# Altium schematic sheet Levels.SchDoc
size Tabloid
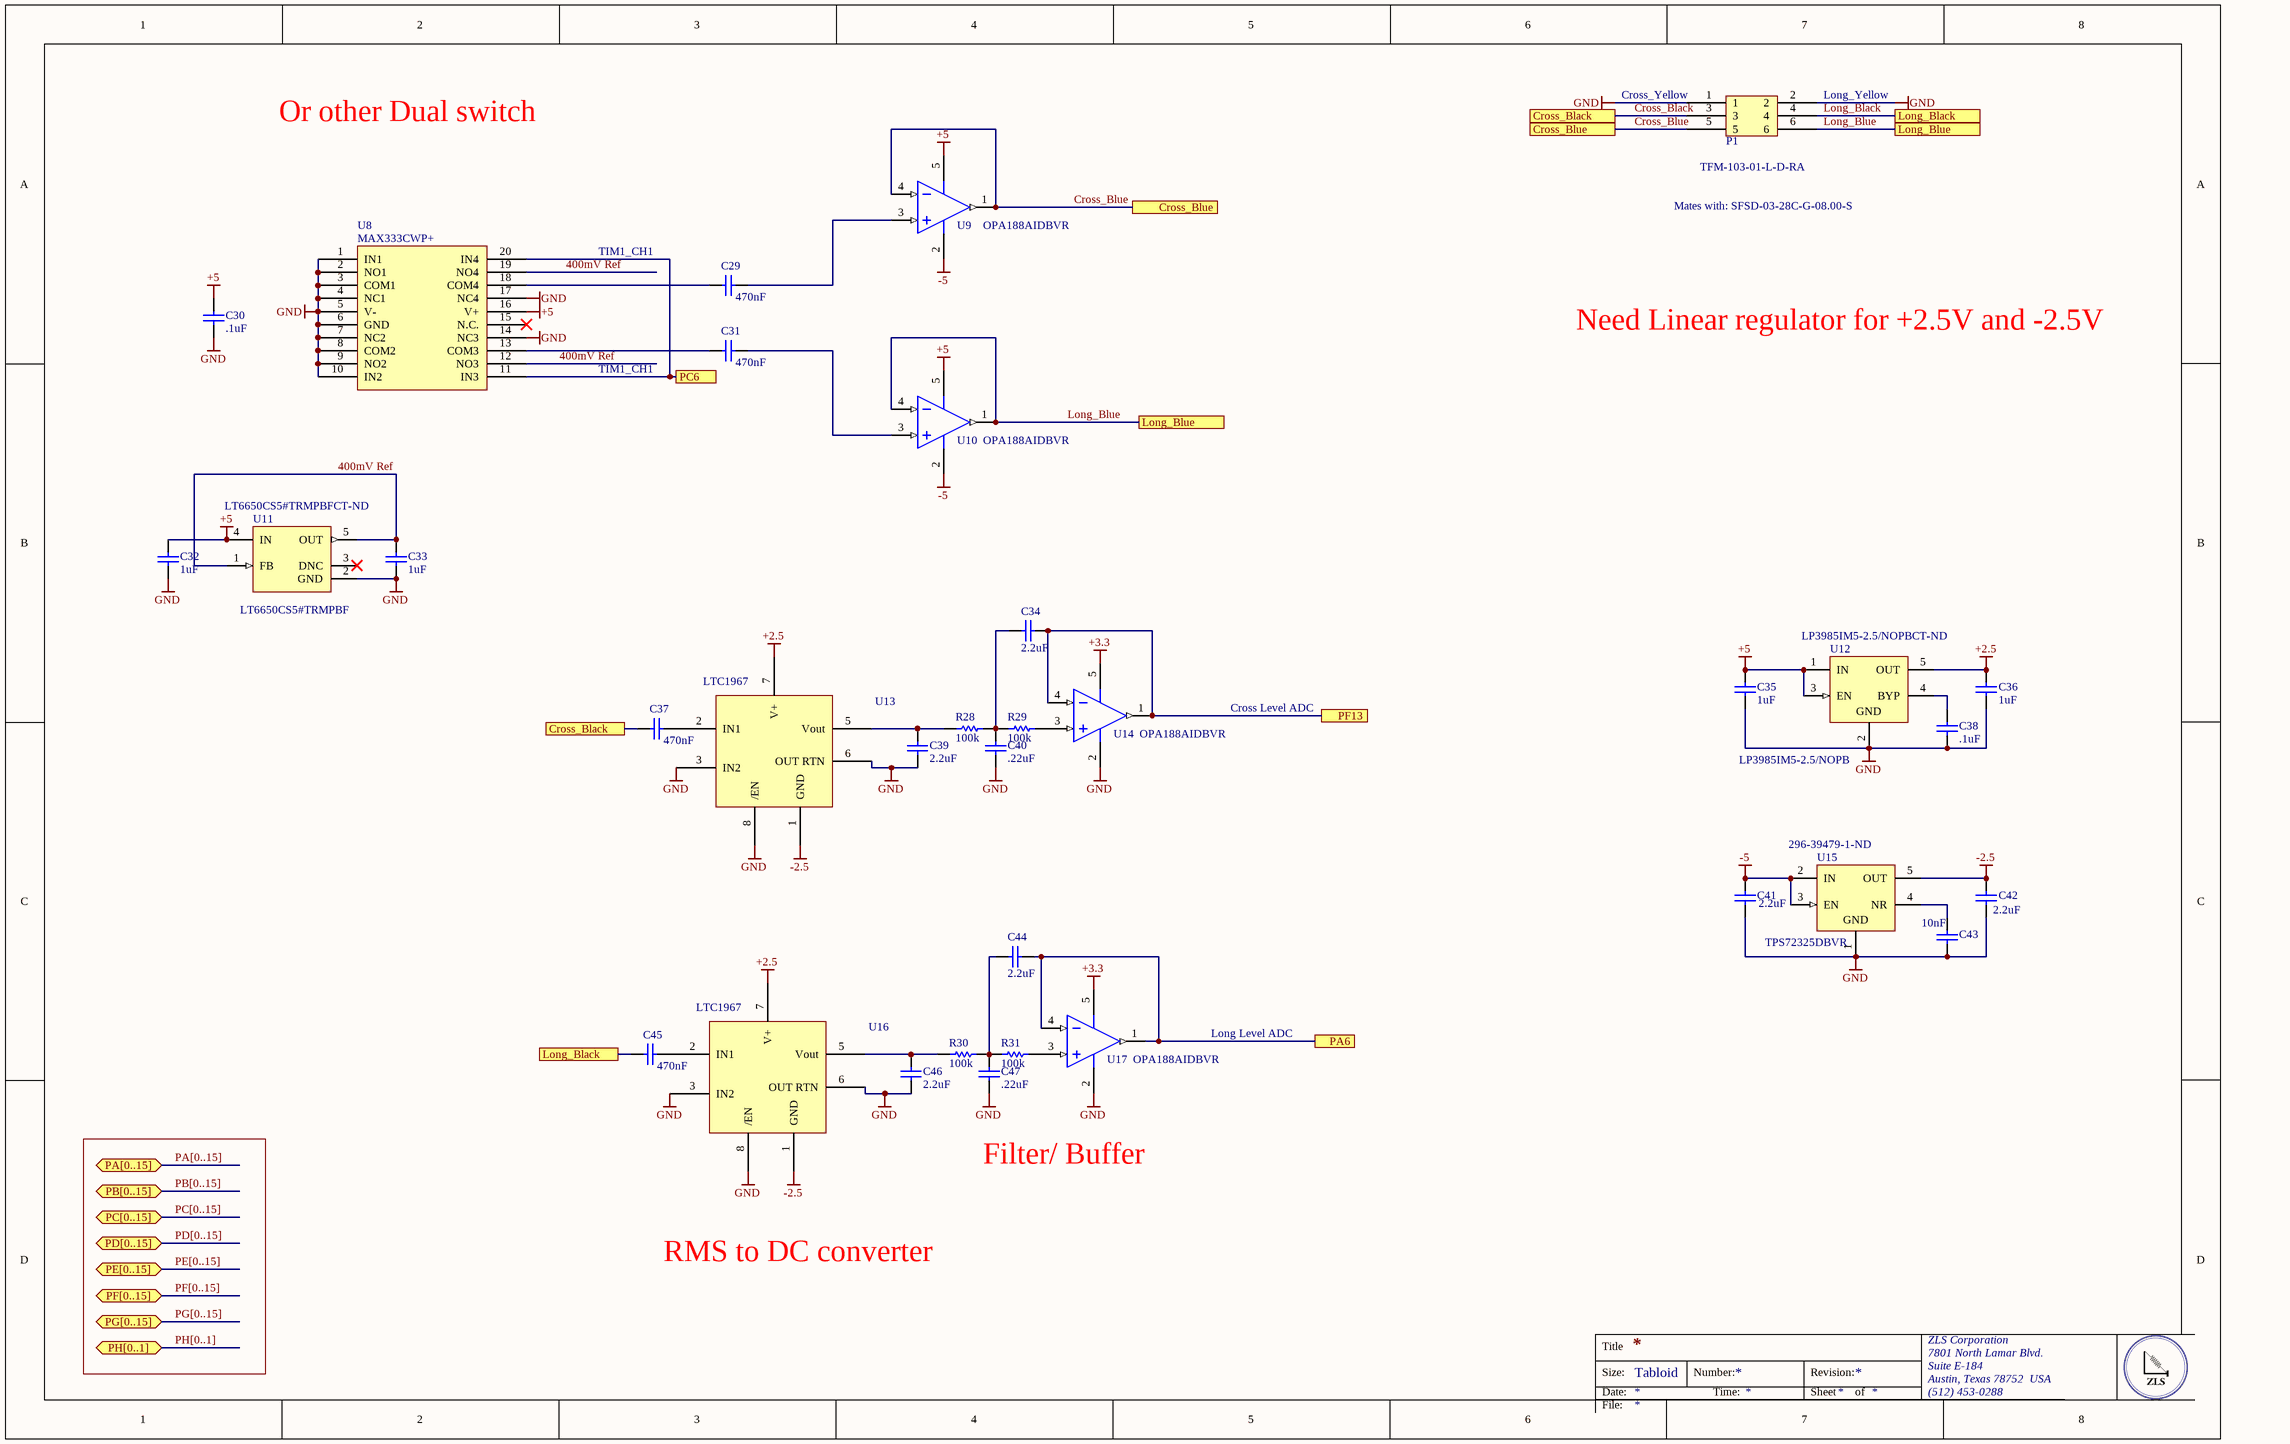
[diagram p0: Levels.SchDoc]

## Parts
C29  470nF  [CAPC0805(2012)75_L]
C30  .1uF  [CAPC0805(2012)75_L]
C31  470nF  [CAPC0805(2012)75_L]
C32  Capacitance: 1uF  [CAPC0805(2012)145_N]  (hidden comment: 08053C105JAT2A)
C33  Capacitance: 1uF  [CAPC0805(2012)145_N]  (hidden comment: 08053C105JAT2A)
C34  2.2uF  [CAPC0805(2012)75_L]
C35  Capacitance: 1uF  [CAPC0805(2012)145_N]  (hidden comment: 08053C105JAT2A)
C36  Capacitance: 1uF  [CAPC0805(2012)145_N]  (hidden comment: 08053C105JAT2A)
C37  470nF  [CAPC0805(2012)75_L]
C38  .1uF  [CAPC0805(2012)75_L]
C39  2.2uF  [CAPC0805(2012)75_L]
C40  .22uF  [CAPC0805(2012)75_L]
C41  Capacitance: 2.2uF  [CAPC2013X135X50ML10T20]  (hidden comment: GRM21BR71A225KA01L)
C42  Capacitance: 2.2uF  [CAPC2013X135X50ML10T20]  (hidden comment: GRM21BR71A225KA01L)
C43  Capacitance: 10nF  [CAPC2013X140X50NL20T25]  (hidden comment: 0805ZC103KAT2A)
C44  2.2uF  [CAPC0805(2012)75_L]
C45  470nF  [CAPC0805(2012)75_L]
C46  2.2uF  [CAPC0805(2012)75_L]
C47  .22uF  [CAPC0805(2012)75_L]
P1  TFM-103-01-L-D-RA  [TFM-103-01-L-D-RA]
R28  100k  [RESC0805(2012)_L]
R29  100k  [RESC0805(2012)_L]
R30  100k  [RESC0805(2012)_L]
R31  100k  [RESC0805(2012)_L]
U8  MAX333CWP+  [TSOP65P640X90-20N]
U9  OPA188AIDBVR  [DBV0005A_M]
U10  OPA188AIDBVR  [DBV0005A_M]
U11  LT6650CS5#TRMPBF  Supplier Part Number 1: LT6650CS5#TRMPBFCT-ND  [LT-S5-5-TSOT-23_N]
U12  LP3985IM5-2.5/NOPB  Supplier Part Number 1: LP3985IM5-2.5/NOPBCT-ND  [DBV0005A_M]
U13  LTC1967  [LTC1967]
U14  OPA188AIDBVR  [DBV0005A_M]
U15  TPS72325DBVR  Supplier Part Number 1: 296-39479-1-ND  [DBV0005A_N]
U16  LTC1967  [LTC1967]
U17  OPA188AIDBVR  [DBV0005A_M]

## Ports
Cross_Black, Cross_Blue, Long_Black, Long_Blue, PA6, PA[0..15] (bidir), PB[0..15] (bidir), PC6, PC[0..15] (bidir), PD[0..15] (bidir), PE[0..15] (bidir), PF13, PF[0..15] (bidir), PG[0..15] (bidir), PH[0..1] (bidir)

## Nets
+2.5: C36.2 U12.5(OUT) U13.7(V+) U16.7(V+)
+3.3: U14.5(V+) U17.5(V+)
+5: C30.2 C32.2 C35.2 U8.16(V+) U9.5(V+) U10.5(V+) U11.4(IN) U12.1(IN) U12.3(EN)
-2.5: C42.2 U13.1(GND) U15.5(OUT) U16.1(GND)
-5: C41.2 U9.2(V-) U10.2(V-) U15.2(IN) U15.3(EN)
GND: C30.1 C32.1 C33.1 C35.1 C36.1 C38.1 C39.1 C40.1 C41.1 C42.1 C43.1 C46.1 C47.1 P1.1 P1.2 U8.1(IN1) U8.2(NO1) U8.3(COM1) U8.4(NC1) U8.5(V-) U8.6(GND) U8.7(NC2) U8.8(COM2) U8.9(NO2) U8.10(IN2) U8.14(NC3) U8.17(NC4) U11.2(GND) U12.2(GND) U13.3(IN2) U13.6(OUT_RTN) U13.8(/EN) U14.2(V-) U15.1(GND) U16.3(IN2) U16.6(OUT_RTN) U16.8(/EN) U17.2(V-)
400mV Ref: C33.2 U8.12(NO3) U8.19(NO4) U11.1(FB) U11.5(OUT)
Cross_Black: C37.1 P1.3 ; port Cross_Black
Cross_Blue: P1.5 U9.1(OUT) U9.4(IN-) ; port Cross_Blue
Long_Black: C45.1 P1.4 ; port Long_Black
Long_Blue: P1.6 U10.1(OUT) U10.4(IN-) ; port Long_Blue
PA6: C44.1 U17.1(OUT) U17.4(IN-) ; port PA6
PC6: U8.11(IN3) U8.20(IN4) ; port PC6
PF13: C34.1 U14.1(OUT) U14.4(IN-) ; port PF13
NetC29_1: C29.1 U8.18(COM4)
NetC29_2: C29.2 U9.3(IN+)
NetC31_1: C31.1 U8.13(COM3)
NetC31_2: C31.2 U10.3(IN+)
NetC34_2: C34.2 C40.2 R28.1 R29.2
NetC37_2: C37.2 U13.2(IN1)
NetC38_2: C38.2 U12.4(BYP)
NetC39_2: C39.2 R28.2 U13.5(Vout)
NetC43_2: C43.2 U15.4(NR)
NetC44_2: C44.2 C47.2 R30.1 R31.2
NetC45_2: C45.2 U16.2(IN1)
NetC46_2: C46.2 R30.2 U16.5(Vout)
NetR29_1: R29.1 U14.3(IN+)
NetR31_1: R31.1 U17.3(IN+)

Not connected (* = marked no-connect by the designer): U8 15(N.C.)*; U11 3(DNC)*; U13 4(NC); U16 4(NC)

## Buses and harness runs
bus PA[0..15] = port PA[0..15]
bus PB[0..15] = port PB[0..15]
bus PC[0..15] = port PC[0..15]
bus PD[0..15] = port PD[0..15]
bus PE[0..15] = port PE[0..15]
bus PF[0..15] = port PF[0..15]
bus PG[0..15] = port PG[0..15]
bus PH[0..1] = port PH[0..1]

## Notes on the sheet
- Or other Dual switch
- (near P1) Cross_Yellow
- (near P1) Long_Yellow
- Mates with: SFSD-03-28C-G-08.00-S
- TIM1_CH1
- Need Linear regulator for +2.5V and -2.5V
- Cross Level ADC
- Long Level ADC
- Filter/ Buffer
- RMS to DC converter
- Title
- Size:
- Date:
- Tabloid
- Number:
- Time:
- Revision:
- Sheet
- of
- ZLS Corporation
- 7801 North Lamar Blvd.
- Suite E-184
- Austin, Texas 78752  USA
- (512) 453-0288
- File:

## Library data of the parts
C29 C31 C37 C45 = CMP-1036-02117-1: CAP 150pF 16V ±10% 0805 (2012 Metric) Thickness 0.75mm SMD; Case-EIA: 0805; Tolerance: Â±10%; Value: .47uF; Case-Metric: 2012; Technology: SMT; Max Thickness: 0.75 mm; Rated Voltage: 16 V
C30 = CMP-1036-02117-1: CAP 150pF 16V ±10% 0805 (2012 Metric) Thickness 0.75mm SMD; Case-EIA: 0805; Tolerance: Â±10%; Case-Metric: 2012; Technology: SMT; Max Thickness: 0.75 mm; Rated Voltage: 16 V; Value: .1uF
C32 C33 C35 C36 = CMP-1036-04752-1: 1µF ±5% 25V Ceramic Capacitor X7R 0805 (2012 Metric); Manufacturer: Kyocera AVX; Tolerance: Â±5%; Case-Metric: 2012; Case-EIA: 0805; Value: 1uF; Technology: SMT; Rated Voltage: 25 V; Max Thickness: 1.45 mm; Supplier 1: Digi-Key; Supplier Part Number 1: 478-10487-1-ND; Manufacturer Part Number: 08053C105JAT2A; Stock 1: 13701; Pricing 1: 1=0.44000, 10=0.30400, 100=0.18220, 500=0.13662, 1000=0.11537 (USD); RoHS: Yes; Mount: Surface Mount; Case/Package: 0805; Number of Pins: 2; Case Code (Metric): 2012; Case Code (Imperial): 0805; Contact Plating: Tin; Min Operating Temperature: -55°C; Max Operating Temperature: 125°C; Packaging: Tape and Reel; Voltage Rating: 25V; Package Quantity: 2000; Dielectric: X7R; Voltage Rating (DC): 25V; Termination: SMD/SMT; Length: 2.01mm; Height: 1.4mm; Width: 0.049inch; Thickness: 0.037inch; Depth: 1.25mm; Radiation Hardening: No; Lead Free: Lead Free; REACH SVHC: Unknown; ComponentLink1URL: https://datasheet.ciiva.com/221/cx7r-221690.pdf?src-supplier=Digi-Key; ComponentLink1Description: https://datasheet.ciiva.com/221/cx7r-221690.pdf?src-supplier=Digi-Key; ComponentLink2URL: https://datasheet.ciiva.com/5419/cx7r-218113-5419770.pdf?src-supplier=Mouser; ComponentLink2Description: https://datasheet.ciiva.com/5419/cx7r-218113-5419770.pdf?src-supplier=Mouser; ComponentLink3URL: https://datasheet.ciiva.com/28586/1679506-28586091.pdf?src-supplier=Element14; ComponentLink3Description: https://datasheet.ciiva.com/28586/1679506-28586091.pdf?src-supplier=Element14; ComponentLink4URL: https://datasheet.ciiva.com/11499/cx7r-11499836.pdf?src-supplier=Avnet; ComponentLink4Description: https://datasheet.ciiva.com/11499/cx7r-11499836.pdf?src-supplier=Avnet
C34 C39 C40 C44 C46 C47 = CMP-1036-02117-1: CAP 150pF 16V ±10% 0805 (2012 Metric) Thickness 0.75mm SMD; Case-EIA: 0805; Tolerance: Â±10%; Value: 1uF; Case-Metric: 2012; Technology: SMT; Max Thickness: 0.75 mm; Rated Voltage: 16 V
C38 = CMP-1036-02117-1: 0.1µF ±10% 25V Ceramic Capacitor X7R 0805 (2012 Metric); Manufacturer: Vishay; Manufacturer Part Number: VJ0805Y104KXXCW1BC; Dielectric Material: Tantalum; Capacitance: 100nF; Supplier 1: Digi-Key; Supplier Part Number 1: 720-1537-1-ND; Stock 1: 72674; Pricing 1: 1=0.26000, 10=0.17900, 100=0.10120, 500=0.07142, 1000=0.06250 (USD); RoHS: Yes; Mount: Surface Mount; Case/Package: 0805; Number of Pins: 2; Weight: 0.000194oz; Case Code (Imperial): 0805; Case Code (Metric): 2012; Min Operating Temperature: -55°C; Max Operating Temperature: 125°C; Tolerance: 10%; Packaging: Tape and Reel; Package Quantity: 4000; Voltage Rating: 25V; Dielectric: X7R; Voltage Rating (DC): 25V; Termination: SMD/SMT; Length: 2mm; Height: 1.45mm; Width: 1.25mm; Thickness: 0.037inch; Depth: 1.25mm; Lead Free: Lead Free; ComponentLink1URL: https://datasheet.ciiva.com/11491/vjw1bcbascomseries-11491758.pdf?src-supplier=Avnet; ComponentLink1Description: https://datasheet.ciiva.com/11491/vjw1bcbascomseries-11491758.pdf?src-supplier=Avnet; ComponentLink2URL: https://datasheet.ciiva.com/176/vjw1bcbascomseries-176875.pdf?src-supplier=Digi-Key; ComponentLink2Description: https://datasheet.ciiva.com/176/vjw1bcbascomseries-176875.pdf?src-supplier=Digi-Key
C41 C42 = CMP-2007-03454-1: 2.2µF ±10% 10V Ceramic Capacitor X7R 0805 (2012 Metric); Manufacturer: Murata; Dissipation Factor: 0.035%; Part Number: GRM21BR71A225KA01L; Supplier 1: Digi-Key; Supplier Part Number 1: 490-1696-1-ND; Manufacturer Part Number: GRM21BR71A225KA01L; Stock 1: 271684; Pricing 1: 1=0.27000, 10=0.18600, 100=0.09440, 500=0.06458, 1000=0.05713 (USD); RoHS: Yes; Mount: Surface Mount; Case/Package: 0805; Number of Pins: 2; Case Code (Imperial): 0805; Case Code (Metric): 2012; Min Operating Temperature: -55°C; Max Operating Temperature: 125°C; Tolerance: 10%; Packaging: Tape and Reel; Package Quantity: 1; Voltage Rating: 10V; Dielectric: X7R; Voltage Rating (DC): 10V; Termination: SMD/SMT; Voltage: 10V; Length: 2mm; Height: 1.25mm; Width: 1.25mm; Thickness: 0.053inch; Depth: 1.25mm; Radiation Hardening: No; REACH SVHC: No SVHC; Lead Free: Lead Free; ComponentLink1URL: https://datasheet.ciiva.com/2989/product-2989712.pdf?src-supplier=Avnet; ComponentLink1Description: https://datasheet.ciiva.com/2989/product-2989712.pdf?src-supplier=Avnet; ComponentLink2URL: https://datasheet.ciiva.com/3778/grm21br71a225ka0123-3778504.pdf?src-supplier=Arrow; ComponentLink2Description: https://datasheet.ciiva.com/3778/grm21br71a225ka0123-3778504.pdf?src-supplier=Arrow; ComponentLink3URL: https://datasheet.ciiva.com/11786/0900766b80936815-11786251.pdf?src-supplier=RSComponents; ComponentLink3Description: https://datasheet.ciiva.com/11786/0900766b80936815-11786251.pdf?src-supplier=RSComponents; ComponentLink4URL: https://datasheet.ciiva.com/16203/product-16203815.pdf?src-supplier=Future+Electronics; ComponentLink4Description: https://datasheet.ciiva.com/16203/product-16203815.pdf?src-supplier=Future+Electronics; ComponentLink5URL: https://datasheet.ciiva.com/135/partnumbering-e-01-135064.pdf?src-supplier=Digi-Key; ComponentLink5Description: https://datasheet.ciiva.com/135/partnumbering-e-01-135064.pdf?src-supplier=Digi-Key; ComponentLink6URL: https://datasheet.ciiva.com/135/partnumbering-e-01-135065.pdf?src-supplier=Digi-Key; ComponentLink6Description: https://datasheet.ciiva.com/135/partnumbering-e-01-135065.pdf?src-supplier=Digi-Key; ComponentLink7URL: https://datasheet.ciiva.com/135/partnumbering-e-01-135066.pdf?src-supplier=Digi-Key; ComponentLink7Description: https://datasheet.ciiva.com/135/partnumbering-e-01-135066.pdf?src-supplier=Digi-Key; ComponentLink8URL: https://datasheet.ciiva.com/22703/608985-22703358.pdf?src-supplier=Element14; ComponentLink8Description: https://datasheet.ciiva.com/22703/608985-22703358.pdf?src-supplier=Element14; ComponentLink9URL: https://datasheet.ciiva.com/2989/product-2989711.pdf?src-supplier=Avnet; ComponentLink9Description: https://datasheet.ciiva.com/2989/product-2989711.pdf?src-supplier=Avnet
C43 = CMP-2007-04770-1: 10000pF ±10% 10V Ceramic Capacitor X7R 0805 (2012 Metric); Manufacturer: AVX Interconnect / Elco; Part Number: 0805ZC103KAT2A; Supplier 1: Digi-Key; Supplier Part Number 1: 478-11396-1-ND; Manufacturer Part Number: 0805ZC103KAT2A; Stock 1: 11980; Pricing 1: 1=0.32000, 10=0.21700, 100=0.11010, 500=0.07534, 1000=0.06665 (USD); RoHS: Yes; Mount: Surface Mount; Case/Package: 0805; Number of Pins: 2; Case Code (Metric): 2012; Case Code (Imperial): 0805; Min Operating Temperature: -55°C; Max Operating Temperature: 125°C; Tolerance: 10%; Packaging: Tape and Reel; Termination: SMD/SMT; Package Quantity: 4000; Dielectric: X7R; Voltage Rating (DC): 10V; Voltage Rating: 10V; Length: 2.01mm; Width: 0.049inch; Depth: 1.25mm; Thickness: 0.037inch; Radiation Hardening: No; REACH SVHC: Unknown; ComponentLink1URL: https://datasheet.ciiva.com/205/cx7r-205251.pdf?src-supplier=Digi-Key; ComponentLink1Description: https://datasheet.ciiva.com/205/cx7r-205251.pdf?src-supplier=Digi-Key; ComponentLink2URL: https://datasheet.ciiva.com/11508/cx7r-11508056.pdf?src-supplier=Avnet; ComponentLink2Description: https://datasheet.ciiva.com/11508/cx7r-11508056.pdf?src-supplier=Avnet; ComponentLink3URL: https://datasheet.ciiva.com/17489/cx7r-17489036.pdf?src-supplier=Avnet+Europe; ComponentLink3Description: https://datasheet.ciiva.com/17489/cx7r-17489036.pdf?src-supplier=Avnet+Europe; ComponentLink4URL: https://datasheet.ciiva.com/5420/cx7r-5420079.pdf?src-supplier=Mouser; ComponentLink4Description: https://datasheet.ciiva.com/5420/cx7r-5420079.pdf?src-supplier=Mouser
P1 = TFM-103-01-L-D-RA: Manufacturer: Samtec; System: Connector; Supplier 1: Mouser; Supplier Part Number 1: 200-TFM10301LDRA; Manufacturer Part Number: TFM-103-01-L-D-RA; Stock 1: 202; Pricing 1: 1=2.15000, 10=1.78000, 50=1.78000, 100=1.33000, 1000=0.98500, 10000=0.92500 (USD); RoHS: No
R28-R31 = CMP-1013-00215-1: 2R55 0.125W 1% 0805 (2012 Metric)  SMD; Case-Metric: 2012; Case-EIA: 0805; Value: 100k; Tolerance: 1 %; Technology: SMT; Power: 0.125 W
U8 = MAX333CWP+: IC SWITCH QUAD SPDT 20TSSOP; Manufacturer: Maxim; Manufacturer Part Number: MAX333AEUP+; Max Supply Voltage: 30V; Min Supply Voltage: 10V; Min Dual Supply Voltage: 4.5V; Max Dual Supply Voltage: 20V; On-State Resistance: 35R; Operating Supply Current: 1uA; Supply Type: Single,Dual; Max Power Dissipation: 559mW; Turn-On Delay Time: 175ns; Turn-Off Delay Time: 145ns; Max Supply Current: 250uA; Number of Bits: 4; Dual Supply Voltage: 15V; Supplier 1: Mouser; Supplier Part Number 1: 700-MAX333AEUP; Stock 1: 664; Pricing 1: 1=6.77, 10=6.43, 50=5.8, 100=5.8, 1000=5.62, 10000=5.62 (USD); Case/Package: TSSOP; Number of Pins: 20; Weight: 0.006737oz; Min Operating Temperature: -40°C; Max Operating Temperature: 85°C; Packaging: Rail/Tube; Package Quantity: 74; Throw Configuration: SPDT; Number of Channels: 4; Length: 6.6mm; Height: 0.95mm; Width: 4.5mm; Radiation Hardening: No; Lead Free: Lead Free; REACH SVHC: Unknown; ComponentLink1URL: https://datasheet.ciiva.com/2978/max333a-2978850.pdf; ComponentLink1Description: https://datasheet.ciiva.com/2978/max333a-2978850.pdf; ComponentLink2URL: https://datasheet.ciiva.com/30478/0900766b81253c85-30478260.pdf; ComponentLink2Description: https://datasheet.ciiva.com/30478/0900766b81253c85-30478260.pdf; ComponentLink3URL: https://datasheet.ciiva.com/1674/max333a-1674617.pdf; ComponentLink3Description: https://datasheet.ciiva.com/1674/max333a-1674617.pdf; ComponentLink4URL: https://datasheet.ciiva.com/26825/max333aeup-26825546.pdf; ComponentLink4Description: https://datasheet.ciiva.com/26825/max333aeup-26825546.pdf
U9 U10 U14 U17 = CMP-0809-00005-2: Precision, Low Noise, Rail-to-Rail Output, Zero-Drift Operational Amplifier, 4 to 36 V, -40 to 125 degC, 5-pin SOT23 (DBV5), Green (RoHS & no Sb/Br); Manufacturer: Texas Instruments; Total Supply Voltage(Min)(+5V is 5, +/-5V is 10): 4; Offset Drift(Typ)(uV/C): 0.03; Rating: Catalog; SubFamily: Zero Drift Precision Amplifier; GBW(Typ)(MHz): 2; Slew Rate(Typ)(V/us): 0.8; Number of Channels: 1; CMRR(Min)(dB): 120; Iq per channel(Max)(mA): 0.51; Total Supply Voltage(Max)(+5V is 5, +/-5V is 10): 36; PartNumber: OPA188AIDBVR; ComponentLink2Description: Datasheet; ComponentLink2URL: http://www.ti.com/lit/ds/symlink/opa188.pdf; ComponentLink1Description: Manufacturer URL; Mounting Technology: Surface Mount; Eco-Plan: Green (RoHS & no Sb/Br); ComponentLink1URL: http://www.ti.com/; PackageVersion: 4073253-4/K, 03/2006; DatasheetVersion: SBOS642A; ComponentLink3Description: Package Specification; PackageReference: DBV0005A; ComponentLink3URL: http://www.ti.com/litv/pdf/mpds018i; PackageDescription: 5-Pin Plastic Small Outline, Body 1.6 x 2.9 mm, Pitch 0.95 mm; Code_JEDEC: MO-178
U11 = CMP-1567-00007-1: Micropower, 400 mV Reference with Rail-to-Rail Buffer Amplifier, 1.4 to 18 V, 0 to 70 degC, 5-Pin SOT-23 (S5), RoHS, Tape and Reel; Manufacturer: Analog Devices / Linear Technology; VIN Max: 18 V; VIN Min: 1.4 V; Number of Channels: 1; Tolerance: 0.75%; Max Input Voltage: 18V; Min Input Voltage: 1.4V; Output Voltage: 400mV; Temperature Coefficient: 30ppm/°C; Quiescent Current: 15uA; Output Current: 200uA; Reference Type: Series; PackageVersion: Rev. B, 06/2010; ComponentLink1Description: Manufacturer URL; Mounting Technology: Surface Mount; PartNumber: LT6650CS5#TRMPBF; Packing: Tape and Reel; PackageDescription: 5-Pin Plastic Thin Small Out-Line Transistor, Body 1.63 x 2.90 mm, Pitch 0.95 mm; Code_JEDEC: MO-193; Temperature Max: 70 degC; ComponentLink2Description: Datasheet; ComponentLink2URL: http://cds.linear.com/docs/en/datasheet/6650fa.pdf; ComponentLink3URL: http://cds.linear.com/docs/en/packaging/SOT_5_05-08-1635.pdf; ComponentLink1URL: http://www.linear.com/; RoHS: TRUE; ComponentLink3Description: Package Specification; Temperature Min: 0 degC; Supplier 1: Digi-Key; Manufacturer Part Number: LT6650CS5#TRMPBF; Stock 1: 3771; Pricing 1: 1=3.18000, 25=2.11040, 100=1.74480, 250=1.65756 (USD); Case/Package: SOT-23-5; Number of Pins: 5; Min Operating Temperature: 0°C; Max Operating Temperature: 70°C; Package Quantity: 1; Packaging: Tape and Reel; Length: 2.9mm; Height: 0.9mm; Width: 1.75mm; Lead Free: Lead Free; ComponentLink4URL: https://datasheet.ciiva.com/6594/1196-6594366.pdf?src-supplier=Digi-Key; ComponentLink4Description: https://datasheet.ciiva.com/6594/1196-6594366.pdf?src-supplier=Digi-Key; ComponentLink5URL: https://datasheet.ciiva.com/48694/001256472-da-01-en-ic-vref-s-lt6650cs5-trmpbf-tsot-23-5-ltc-48694695.pdf?src-supplier=Conrad; ComponentLink5Description: https://datasheet.ciiva.com/48694/001256472-da-01-en-ic-vref-s-lt6650cs5-trmpbf-tsot-23-5-ltc-48694695.pdf?src-supplier=Conrad
U12 = CMP-0062-01907-3: Micropower, 150mA Low-Noise Ultra Low-Dropout CMOS Voltage Regulator, 5-pin SOT-23, Pb-Free; Manufacturer: Texas Instruments; PackageTopMarking: LCSB*XTT; PowerWise: N; CompType: LDO IC; Max Input Voltage: 6V; Output Voltage: 2.5V; Number of Outputs: 1; Max Power Dissipation: 250mW; Polarity: Positive; Quiescent Current: 150uA; Accuracy: 2%; Output Type: Fixed; Dropout Voltage: 60mV; Current Rating: 150A; ComponentLink1Description: Datasheet URL; PinCount: 5; RoHS: Y; PackageDescription: Molded SOT-23, .115 x .063 x .040 in Body, 5 Lead, .0375 in Pitch; ComponentLink1URL: http://www.ti.com/general/docs/lit/getliterature.tsp?genericPartNumber=LP3985&fileType=pdf; PackageReference: DBV0005A; Supplier 1: Digi-Key; Manufacturer Part Number: LP3985IM5-2.5/NOPB; Stock 1: 16680; Pricing 1: 1=0.66000, 10=0.57800, 100=0.44300, 500=0.35020 (USD); Mount: Surface Mount; Case/Package: SOT-23; Number of Pins: 5; Contact Plating: Tin; Min Operating Temperature: -40°C; Max Operating Temperature: 125°C; Max Output Current: 150mA; Min Input Voltage: 2.5V; Output Current: 150mA; Packaging: Tape and Reel; Power Dissipation: 250mW; Output Voltage Accuracy: 2%; Nominal Output Voltage: 2.5V; Termination: SMD/SMT; Max Supply Voltage: 6V; Min Supply Voltage: 2.5V; Max Output Voltage: 2.5V; Length: 2.92mm; Height: 1.02mm; Width: 1.6mm; Lead Free: Lead Free; REACH SVHC: No SVHC; ComponentLink2URL: https://datasheet.ciiva.com/46441/10171-46441111.pdf?src-supplier=Element14; ComponentLink2Description: https://datasheet.ciiva.com/46441/10171-46441111.pdf?src-supplier=Element14; ComponentLink3URL: https://datasheet.ciiva.com/49047/1882660-49047100.pdf?src-supplier=Element14; ComponentLink3Description: https://datasheet.ciiva.com/49047/1882660-49047100.pdf?src-supplier=Element14; ComponentLink4URL: https://datasheet.ciiva.com/46383/1882660-46383391.pdf?src-supplier=Element14; ComponentLink4Description: https://datasheet.ciiva.com/46383/1882660-46383391.pdf?src-supplier=Element14
U13 U16 = LTC1967: IC CONVERTER RMS-DC PREC 9MSOP
U15 = CMP-0394-00292-2: Single Output High PSRR LDO, 200 mA, Fixed -2.5 V Output, -10 to -2.7 V Input, 5-pin SOT-23 (DBV), -40 to 125 degC, Green (RoHS & no Sb/Br); Manufacturer: Texas Instruments; Iout(Max)(A): 0.2; Iq(Typ)(mA): 0.13; Accuracy(%): 2; Vdo(Typ)(mV): 280; SubFamily: Single Channel LDO; Number of Outputs: 1; Output Voltage: -2.5V; Max Power Dissipation: 560mW; Dropout Voltage: 280mV; Output Current: 200mA; Max Input Voltage: -2.7V; Min Input Voltage: -10V; Min Current Limit: 300mA; Input Bias Current: 130uA; Polarity: Negative; Output Voltage Accuracy: 1%; Accuracy: 2%; Vin(Max)(V): -2.7; PartNumber: TPS72325DBVR; PackageReference: DBV0005A; ComponentLink3Description: Package Specification; Fixed Output Options(V): -2.5; ComponentLink1URL: http://www.ti.com/; ComponentLink1Description: Manufacturer URL; Mounting Technology: Surface Mount; PackageDescription: 5-Pin Plastic Small Outline, Body 1.60 Ãƒâ€” 2.90 mm, Pitch 0.95 mm; ComponentLink2URL: http://www.ti.com/general/docs/lit/getliterature.tsp?genericPartNumber=TPS72325&fileType=pdf; PackageVersion: 4073253-4/K; ComponentLink3URL: http://www.ti.com/litv/pdf/mpds018i; Vout Adj(Min)(V): -2.5; ComponentLink2Description: Datasheet; Vout Adj(Max)(V): -2.5; Eco-Plan: Green (RoHS & no Sb/Br); DatasheetVersion: SLVS346B; Vin(Min)(V): -10; Code_JEDEC: MO-178; Supplier 1: Digi-Key; Manufacturer Part Number: TPS72325DBVR; Stock 1: 6951; Pricing 1: 1=2.81000, 10=2.52200, 100=2.02720, 500=1.66552, 1000=1.37999 (USD); RoHS: Yes; Case/Package: SOT-23; Number of Pins: 5; Contact Plating: Tin; Min Operating Temperature: -40°C; Max Operating Temperature: 125°C; Packaging: Tape and Reel; Package Quantity: 3000; Max Output Current: 200mA; Number of Regulators: 1; Power Dissipation: 560mW; Min Output Voltage: -2.5V; Quiescent Current: 130uA; Max Output Voltage: -2.5V; Output Type: Fixed; Nominal Output Voltage: -2.5V; Radiation Hardening: No; Lead Free: Lead Free; REACH SVHC: No SVHC; ComponentLink4URL: http://www.mouser.com/ds/2/405/slvs346c-521947.pdf?src-supplier=Mouser; ComponentLink4Description: http://www.mouser.com/ds/2/405/slvs346c-521947.pdf?src-supplier=Mouser; ComponentLink5URL: http://components.arrow.com/part/dataview/0323_00141856?src-supplier=Arrow+Europe; ComponentLink5Description: http://components.arrow.com/part/dataview/0323_00141856?src-supplier=Arrow+Europe; ComponentLink6URL: http://www.ti.com/general/docs/lit/getliterature.tsp?genericPartNumber=TPS723&amp;&amp;fileType=pdf&src-supplier=Newark; ComponentLink6Description: http://www.ti.com/general/docs/lit/getliterature.tsp?genericPartNumber=TPS723&amp;&amp;fileType=pdf&src-supplier=Newark; ComponentLink7URL: http://focus.ti.com/lit/ds/symlink/tps72325.pdf?src-supplier=Avnet+Europe; ComponentLink7Description: http://focus.ti.com/lit/ds/symlink/tps72325.pdf?src-supplier=Avnet+Europe; ComponentLink8URL: http://www.ti.com/general/docs/lit/getliterature.tsp?genericPartNumber=TPS723&amp;&amp;fileType=pdf&src-supplier=Farnell; ComponentLink8Description: http://www.ti.com/general/docs/lit/getliterature.tsp?genericPartNumber=TPS723&amp;&amp;fileType=pdf&src-supplier=Farnell; ComponentLink9URL: http://www.ti.com/general/docs/lit/getliterature.tsp?genericPartNumber=TPS723&&fileType=pdf&src-supplier=Avnet+Asia; ComponentLink9Description: http://www.ti.com/general/docs/lit/getliterature.tsp?genericPartNumber=TPS723&&fileType=pdf&src-supplier=Avnet+Asia; ComponentLink10URL: http://www.ti.com/general/docs/lit/getliterature.tsp?genericPartNumber=TPS723&&fileType=pdf&src-supplier=Avnet; ComponentLink10Description: http://www.ti.com/general/docs/lit/getliterature.tsp?genericPartNumber=TPS723&&fileType=pdf&src-supplier=Avnet; ComponentLink11URL: http://components.arrow.com/part/dataview/40177093S9611537N7713?src-supplier=Arrow; ComponentLink11Description: http://components.arrow.com/part/dataview/40177093S9611537N7713?src-supplier=Arrow; ComponentLink12URL: http://www.ti.com/lit/ds/symlink/tps723.pdf?src-supplier=Digi-Key; ComponentLink12Description: http://www.ti.com/lit/ds/symlink/tps723.pdf?src-supplier=Digi-Key; ComponentLink13URL: http://www.ti.com/general/docs/lit/getliterature.tsp?genericPartNumber=TPS723&&fileType=pdf&src-supplier=Element14; ComponentLink13Description: http://www.ti.com/general/docs/lit/getliterature.tsp?genericPartNumber=TPS723&&fileType=pdf&src-supplier=Element14; ComponentLink14URL: http://www.ti.com/lit/ds/symlink/tps72301.pdf?src-supplier=Digi-Key; ComponentLink14Description: http://www.ti.com/lit/ds/symlink/tps72301.pdf?src-supplier=Digi-Key